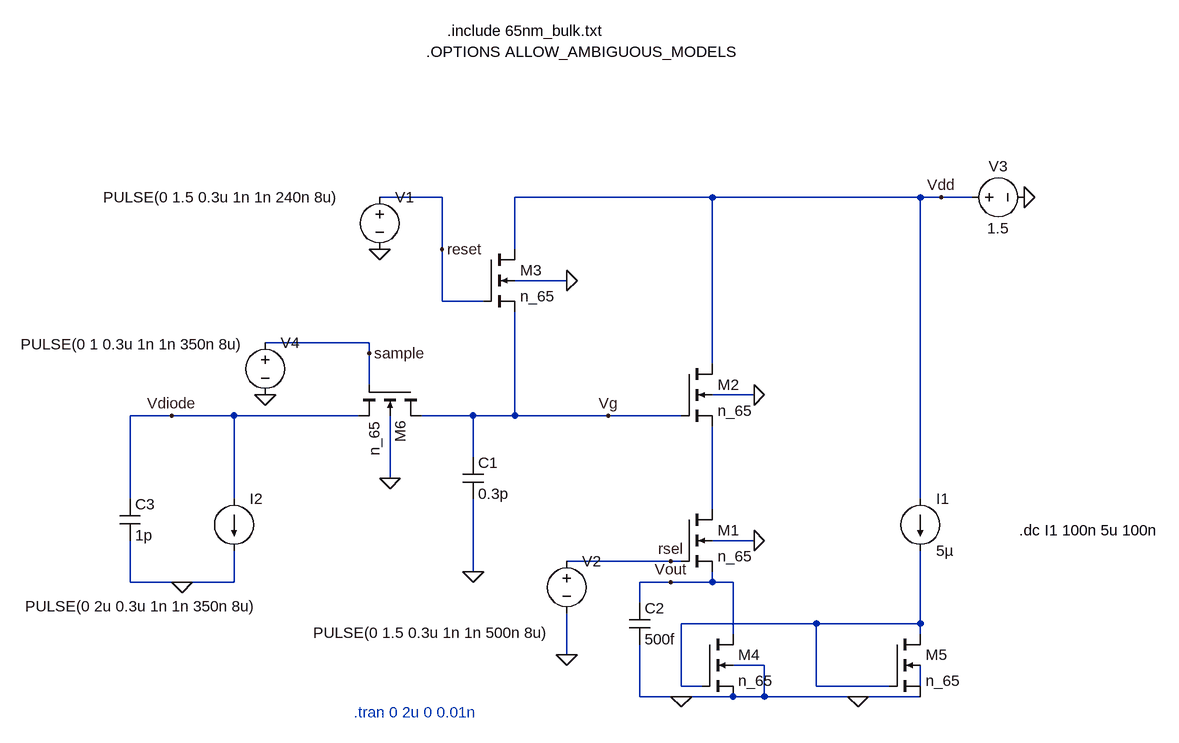
[diagram p0: schematic T4 aps.asc]
T4 aps.asc, the LTspice schematic file:
Version 4.1
SHEET 1 932 680
WIRE -192 -352 -288 -352
WIRE 224 -352 -80 -352
WIRE 544 -352 224 -352
WIRE 576 -352 544 -352
WIRE 624 -352 576 -352
WIRE -192 -272 -192 -352
WIRE -80 -272 -80 -352
WIRE 0 -224 -80 -224
WIRE -192 -192 -192 -272
WIRE -128 -192 -192 -192
WIRE -304 -128 -464 -128
WIRE -304 -112 -304 -128
WIRE 224 -96 224 -352
WIRE -304 -64 -304 -112
WIRE 288 -48 224 -48
WIRE -608 -16 -672 -16
WIRE -512 -16 -608 -16
WIRE -320 -16 -512 -16
WIRE -144 -16 -224 -16
WIRE -80 -16 -80 -176
WIRE -80 -16 -144 -16
WIRE 64 -16 -80 -16
WIRE 176 -16 64 -16
WIRE -144 48 -144 -16
WIRE -272 80 -272 -16
WIRE -672 112 -672 -16
WIRE -512 112 -512 -16
WIRE 544 112 544 -352
WIRE 224 128 224 0
WIRE 288 176 224 176
WIRE 160 208 0 208
WIRE 176 208 160 208
WIRE -144 224 -144 112
WIRE -672 240 -672 176
WIRE -592 240 -672 240
WIRE -512 240 -512 192
WIRE -512 240 -592 240
WIRE 160 240 112 240
WIRE 224 240 224 224
WIRE 224 240 160 240
WIRE 256 240 224 240
WIRE 112 272 112 240
WIRE 384 304 176 304
WIRE 544 304 544 192
WIRE 544 304 384 304
WIRE 256 320 256 240
WIRE 544 320 544 304
WIRE 0 352 0 288
WIRE 304 368 256 368
WIRE 176 400 176 304
WIRE 208 400 176 400
WIRE 384 400 384 304
WIRE 496 400 384 400
WIRE 544 400 544 368
WIRE 112 416 112 336
WIRE 176 416 112 416
WIRE 256 416 176 416
WIRE 304 416 304 368
WIRE 304 416 256 416
WIRE 448 416 304 416
WIRE 544 416 448 416
FLAG -288 -272 0
FLAG -144 224 0
FLAG 176 416 0
FLAG 448 416 0
FLAG 0 352 0
FLAG 0 -224 0
FLAG 288 -48 0
FLAG 288 176 0
FLAG 704 -352 0
FLAG -272 80 0
FLAG -592 240 0
FLAG 160 240 Vout
FLAG 64 -16 Vg
FLAG -464 -48 0
FLAG -304 -112 sample
FLAG -608 -16 Vdiode
FLAG 160 208 rsel
FLAG 576 -352 Vdd
FLAG -192 -272 reset
SYMBOL nmos4 176 128 R0
SYMATTR InstName M1
SYMATTR Value n_65
SYMATTR Value2 l=65n w=1u
SYMBOL nmos4 176 -96 R0
SYMATTR InstName M2
SYMATTR Value n_65
SYMATTR Value2 l=65n w=4u
SYMBOL nmos4 -128 -272 R0
SYMATTR InstName M3
SYMATTR Value n_65
SYMATTR Value2 l=65n w=0.5u
SYMBOL nmos4 208 320 R0
SYMATTR InstName M4
SYMATTR Value n_65
SYMBOL nmos4 496 320 R0
SYMATTR InstName M5
SYMATTR Value n_65
SYMBOL nmos4 -224 -64 R90
SYMATTR InstName M6
SYMATTR Value n_65
SYMATTR Value2 l=2u w=2u
SYMBOL voltage -288 -368 R0
WINDOW 3 -425 16 Left 2
WINDOW 123 0 0 Left 0
WINDOW 39 0 0 Left 0
SYMATTR InstName V1
SYMATTR Value PULSE(0 1.5 0.3u 1n 1n 240n 8u)
SYMBOL cap -160 48 R0
SYMATTR InstName C1
SYMATTR Value 0.3p
SYMBOL cap 96 272 R0
SYMATTR InstName C2
SYMATTR Value 500f
SYMBOL current 544 112 R0
WINDOW 123 0 0 Left 0
WINDOW 39 0 0 Left 0
SYMATTR InstName I1
SYMATTR Value 5µ
SYMBOL voltage 0 192 R0
WINDOW 3 -390 126 Left 2
WINDOW 123 0 0 Left 0
WINDOW 39 0 0 Left 0
SYMATTR InstName V2
SYMATTR Value PULSE(0 1.5 0.3u 1n 1n 500n 8u)
SYMBOL voltage 608 -352 R270
WINDOW 0 32 56 VTop 2
WINDOW 3 -32 56 VBottom 2
WINDOW 123 0 0 Left 0
WINDOW 39 0 0 Left 0
SYMATTR InstName V3
SYMATTR Value 1.5
SYMBOL current -512 112 R0
WINDOW 3 -321 165 Left 2
WINDOW 123 0 0 Left 0
WINDOW 39 0 0 Left 0
SYMATTR InstName I2
SYMATTR Value PULSE(0 2u 0.3u 1n 1n 350n 8u)
SYMBOL cap -688 112 R0
SYMATTR InstName C3
SYMATTR Value 1p
SYMBOL voltage -464 -144 R0
WINDOW 3 -376 18 Left 2
WINDOW 123 0 0 Left 0
WINDOW 39 0 0 Left 0
SYMATTR InstName V4
SYMATTR Value PULSE(0 1 0.3u 1n 1n 350n 8u)
TEXT -184 -608 Left 2 !.include 65nm_bulk.txt
TEXT -216 -576 Left 2 !.OPTIONS ALLOW_AMBIGUOUS_MODELS
TEXT -328 440 Left 2 ;.tran 0 2u 0 0.01n
TEXT 696 160 Left 2 !.dc I1 100n 5u 100n

The netlist it stands for:
* T4 aps.asc
M1 N001 rsel Vout 0 n_65 l=65n w=1u
M2 Vdd Vg N001 0 n_65 l=65n w=4u
M3 Vdd reset Vg 0 n_65 l=65n w=0.5u
M4 Vout N002 0 0 n_65
M5 N002 N002 0 N003 n_65
M6 Vg sample Vdiode 0 n_65 l=2u w=2u
V1 reset 0 PULSE(0 1.5 0.3u 1n 1n 240n 8u)
C1 Vg 0 0.3p
C2 Vout 0 500f
I1 Vdd N002 5µ
V2 rsel 0 PULSE(0 1.5 0.3u 1n 1n 500n 8u)
V3 Vdd 0 1.5
I2 Vdiode 0 PULSE(0 2u 0.3u 1n 1n 350n 8u)
C3 Vdiode 0 1p
V4 sample 0 PULSE(0 1 0.3u 1n 1n 350n 8u)
.model NMOS NMOS
.model PMOS PMOS
.lib standard.mos
.include 65nm_bulk.txt
.OPTIONS ALLOW_AMBIGUOUS_MODELS
* .tran 0 2u 0 0.01n
.dc I1 100n 5u 100n
.backanno
.end